# Altium schematic sheet digital.SchDoc
size B
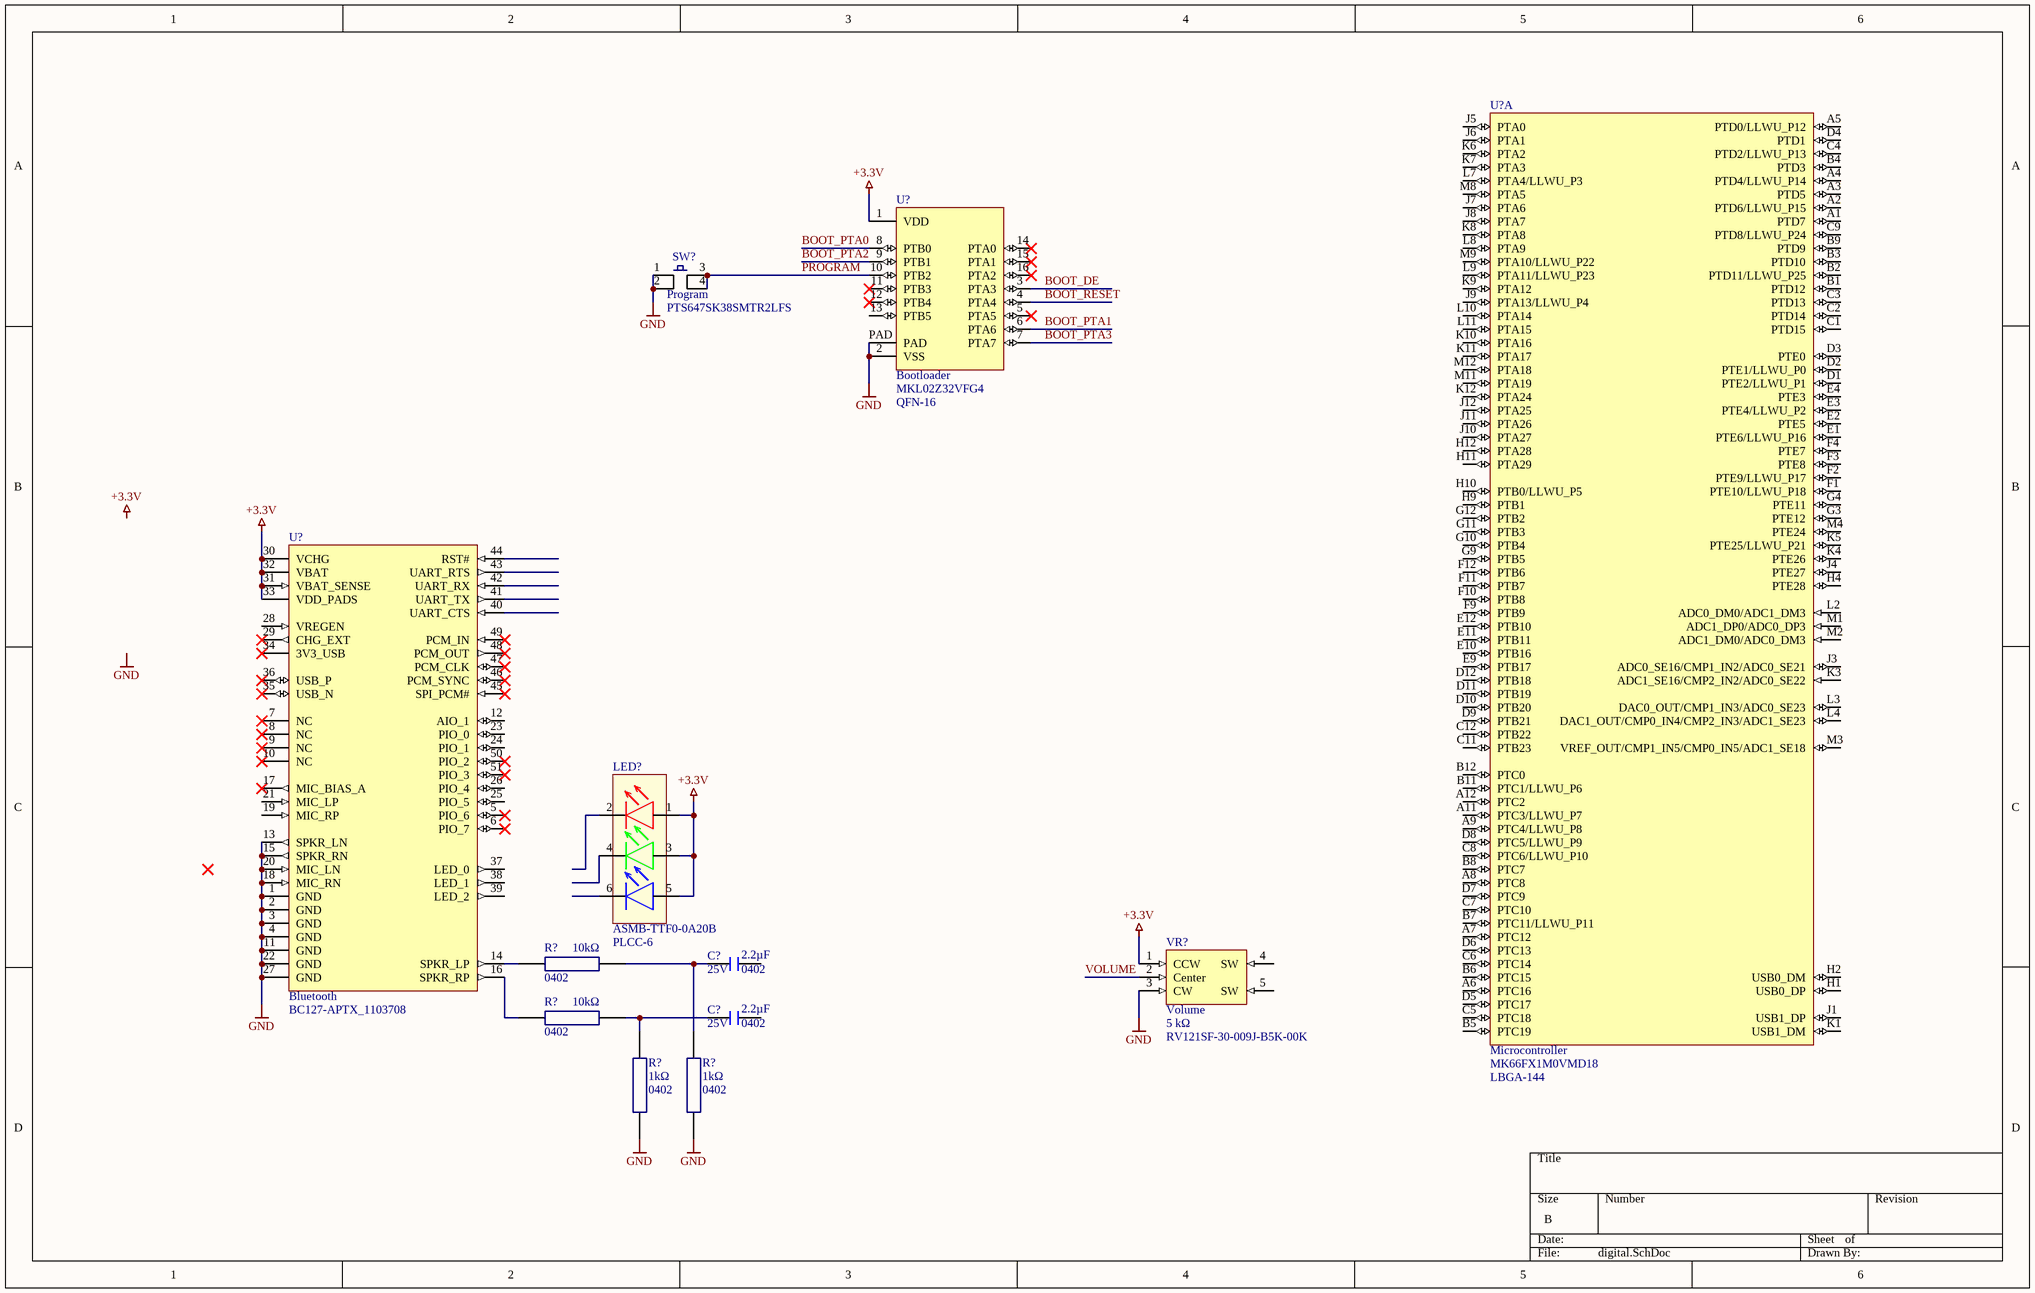
[diagram p0: digital.SchDoc]

## Parts
(Parts that share a designator on the sheet are numbered #1, #2 ... from top to bottom, then left to right.)
C?#1  Size Code: 0402  Capacitance: 2.2µF  Rated DC Voltage (URdc): 25V  [0402_capacitor]  (hidden comment: TMK105CBJ225MV-F)
C?#2  Size Code: 0402  Capacitance: 2.2µF  Rated DC Voltage (URdc): 25V  [0402_capacitor]  (hidden comment: TMK105CBJ225MV-F)
LED?  ASMB-TTF0-0A20B  [PLCC-6]
R?#1  Case Code (Imperial): 0402  Resistance: 10kΩ  [0402_resistor]  (hidden comment: RMCF0402FT10K0)
R?#2  Case Code (Imperial): 0402  Resistance: 10kΩ  [0402_resistor]  (hidden comment: RMCF0402FT10K0)
R?#3  Resistance: 1kΩ  Size Code: 0402  [0402_resistor]  (hidden comment: RMCF0402FT1K00)
R?#4  Resistance: 1kΩ  Size Code: 0402  [0402_resistor]  (hidden comment: RMCF0402FT1K00)
SW?  Program  [PTS647SK38SMTR2LFS]
U?#1  Bootloader  [QFN-16]
U?#2  Microcontroller  Package: LBGA-144  [BGA-144]  (part A of 2)
U?#3  Bluetooth  [BC127]
VR?  Volume  Resistance: 5 kΩ  [RV121SF-30-009J-B5K-00K]

## Nets
+3.3V: LED?.1 LED?.3 LED?.5 U?#1.1(VDD) U?#3.30(VCHG) U?#3.31(VBAT_SENSE) U?#3.32(VBAT) U?#3.33(VDD_PADS) VR?.1(CCW)
GND: R?#3.1 R?#4.1 SW?.1 SW?.2 U?#1.2(VSS) U?#1.PAD U?#3.1(GND) U?#3.2(GND) U?#3.3(GND) U?#3.4(GND) U?#3.11(GND) U?#3.13(SPKR_LN) U?#3.15(SPKR_RN) U?#3.18(MIC_RN) U?#3.20(MIC_LN) U?#3.22(GND) U?#3.27(GND) VR?.3(CW)
BOOT_DE: U?#1.3(PTA3)
BOOT_PTA0: U?#1.8(PTB0)
BOOT_PTA1: U?#1.6(PTA6)
BOOT_PTA2: U?#1.9(PTB1)
BOOT_PTA3: U?#1.7(PTA7)
BOOT_RESET: U?#1.4(PTA4)
PROGRAM: SW?.3 SW?.4 U?#1.10(PTB2)
VOLUME: VR?.2(Center)
NetC?#1_1: C?#1.1 R?#1.2 R?#4.2
NetC?#2_1: C?#2.1 R?#2.2 R?#3.2
NetR?#1_1: R?#1.1 U?#3.14(SPKR_LP)
NetR?#2_1: R?#2.1 U?#3.16(SPKR_RP)

Not connected (* = marked no-connect by the designer): C?#1 2; C?#2 2; LED? 2 4 6; U?#1 5(PTA5)* 11(PTB3)* 12(PTB4)* 13(PTB5) 14(PTA0)* 15(PTA1)* 16(PTA2)*; U?#2 A1(PTD7) A2(PTD6/LLWU_P15) A3(PTD5) A4(PTD4/LLWU_P14) A5(PTD0/LLWU_P12) A6(PTC16) A7(PTC12) A8(PTC8) A9(PTC4/LLWU_P8) A11(PTC3/LLWU_P7) A12(PTC2) B1(PTD12) B2(PTD11/LLWU_P25) B3(PTD10) B4(PTD3) B5(PTC19) B6(PTC15) B7(PTC11/LLWU_P11) B8(PTC7) B9(PTD9) B11(PTC1/LLWU_P6) B12(PTC0) C1(PTD15) C2(PTD14) C3(PTD13) C4(PTD2/LLWU_P13) C5(PTC18) C6(PTC14) C7(PTC10) C8(PTC6/LLWU_P10) C9(PTD8/LLWU_P24) C11(PTB23) C12(PTB22) D1(PTE2/LLWU_P1) D2(PTE1/LLWU_P0) D3(PTE0) D4(PTD1) D5(PTC17) D6(PTC13) D7(PTC9) D8(PTC5/LLWU_P9) D9(PTB21) D10(PTB20) D11(PTB19) D12(PTB18) E1(PTE6/LLWU_P16) E2(PTE5) E3(PTE4/LLWU_P2) E4(PTE3) E9(PTB17) E10(PTB16) E11(PTB11) E12(PTB10) F1(PTE10/LLWU_P18) F2(PTE9/LLWU_P17) F3(PTE8) F4(PTE7) F9(PTB9) F10(PTB8) F11(PTB7) F12(PTB6) G3(PTE12) G4(PTE11) G9(PTB5) G10(PTB4) G11(PTB3) G12(PTB2) H1(USB0_DP) H2(USB0_DM) H4(PTE28) H9(PTB1) H10(PTB0/LLWU_P5) H11(PTA29) H12(PTA28) J1(USB1_DP) J3(ADC0_SE16/CMP1_IN2/ADC0_SE21) J4(PTE27) J5(PTA0) J6(PTA1) J7(PTA6) J8(PTA7) J9(PTA13/LLWU_P4) J10(PTA27) J11(PTA26) J12(PTA25) K1(USB1_DM) K3(ADC1_SE16/CMP2_IN2/ADC0_SE22) K4(PTE26) K5(PTE25/LLWU_P21) K6(PTA2) K7(PTA3) K8(PTA8) K9(PTA12) K10(PTA16) K11(PTA17) K12(PTA24) L2(ADC0_DM0/ADC1_DM3) L3(DAC0_OUT/CMP1_IN3/ADC0_SE23) L4(DAC1_OUT/CMP0_IN4/CMP2_IN3/ADC1_SE23) L7(PTA4/LLWU_P3) L8(PTA9) L9(PTA11/LLWU_P23) L10(PTA14) L11(PTA15) M1(ADC1_DP0/ADC0_DP3) M2(ADC1_DM0/ADC0_DM3) M3(VREF_OUT/CMP1_IN5/CMP0_IN5/ADC1_SE18) M4(PTE24) M8(PTA5) M9(PTA10/LLWU_P22) M11(PTA19) M12(PTA18); U?#3 5(PIO_6)* 6(PIO_7)* 7(NC)* 8(NC)* 9(NC)* 10(NC)* 12(AIO_1) 17(MIC_BIAS_A)* 19(MIC_RP) 21(MIC_LP) 23(PIO_0) 24(PIO_1) 25(PIO_5) 26(PIO_4) 28(VREGEN) 29(CHG_EXT)* 34(3V3_USB)* 35(USB_N)* 36(USB_P)* 37(LED_0) 38(LED_1) 39(LED_2) 40(UART_CTS) 41(UART_TX) 42(UART_RX) 43(UART_RTS) 44(RST#) 45(SPI_PCM#)* 46(PCM_SYNC)* 47(PCM_CLK)* 48(PCM_OUT)* 49(PCM_IN)* 50(PIO_2)* 51(PIO_3)*; VR? 4(SW) 5(SW)

## Notes on the sheet
- Labels drawn without touching a wire or pin: +3.3V, GND

## Library data of the parts
C?#1 C?#2 = TMK105CBJ225MV-F: 2.2 µF, 25 V, X5R, 0402 Chip Capacitor; Manufacturer: Taiyo Yuden; Dielectric Material: Ceramic; Multilayer: Yes; Negative Tolerance: 20%; Supplier 1: Digi-Key; Supplier Part Number 1: 587-6022-1-ND; RoHS: Yes; Category: Ceramic Capacitors; Stock 1: 6102; Pricing 1: 1=0.22000, 10=0.15600, 50=0.08880, 100=0.07350, 500=0.05156, 1000=0.04269, 2500=0.03973, 5000=0.03635 (USD); Mount: Surface Mount; Number of Pins: 2; Package Shape: Rectangular; Min Operating Temperature: -55°C; Max Operating Temperature: 85°C; Capacitor Type: Ceramic; Package Style: SMTMeter; Packaging: Tape and Reel; Positive Tolerance: 20%; Temperature Characteristics Code: X5R; Termination: Wraparound; Length: 1mm; Width: 0.5mm; Height: 0.5mm; REACH SVHC: Yes; RoHS Compliant: Yes; ComponentLink1URL: https://datasheet.ciiva.com:443/pdfs/VipMasterIC/IC/TAIY/TAIY-S-A0009103435/TAIY-S-A0009102688-1.pdf?src-supplier=IHS+Markit; ComponentLink1Description: https://datasheet.ciiva.com:443/pdfs/VipMasterIC/IC/TAIY/TAIY-S-A0009103435/TAIY-S-A0009102688-1.pdf?src-supplier=IHS+Markit; ComponentLink2URL: https://ds.yuden.co.jp/TYCOMPAS/ut/detail?pn=TMK105CBJ225MV-F &amp;u=M&src-supplier=Digi-Key; ComponentLink2Description: https://ds.yuden.co.jp/TYCOMPAS/ut/detail?pn=TMK105CBJ225MV-F &amp;u=M&src-supplier=Digi-Key; ComponentLink3URL: http://ds.yuden.co.jp/TYCOMPAS/ut/detail.do?productNo=TMK105CBJ225MV-F&amp;fileName=TMK105CBJ225MV-F_SS&amp;mode=specSheetDownload&src-supplier=Digi-Key; ComponentLink3Description: http://ds.yuden.co.jp/TYCOMPAS/ut/detail.do?productNo=TMK105CBJ225MV-F&amp;fileName=TMK105CBJ225MV-F_SS&amp;mode=specSheetDownload&src-supplier=Digi-Key; Manufacturer Part Number: TMK105CBJ225MV-F
LED? = ASMB-TTF0-0A20B: RGB LED; Manufacturer: Broadcom Avago; Color: Blue,Green,Red; Lens Style: Round,Flat; Lens Transparency: Diffused; Luminous Intensity: 410mcd; Forward Voltage: 2.9V; Test Current: 20mA; Viewing Angle: 110°; Dominant Wavelength: 471nm; Supplier 1: Digi-Key; RoHS: Yes; Category: LEDs; Stock 1: 27651; Pricing 1: 1=0.55000, 10=0.33900, 100=0.19500, 1000=0.15264 (USD); Mount: Surface Mount; Number of Pins: 6; Packaging: Cut Tape; Length: 3.7mm; Width: 3.5mm; Height: 3mm; RoHS Compliant: Yes; ComponentLink1URL: https://media.digikey.com/pdf/Data%20Sheets/Avago%20PDFs/ASMB-TTF0-0A20B.pdf?src-supplier=Digi-Key; ComponentLink1Description: https://media.digikey.com/pdf/Data%20Sheets/Avago%20PDFs/ASMB-TTF0-0A20B.pdf?src-supplier=Digi-Key; ComponentLink2URL: http://www.farnell.com/datasheets/2608170.pdf?src-supplier=Farnell; ComponentLink2Description: http://www.farnell.com/datasheets/2608170.pdf?src-supplier=Farnell; ComponentLink3URL: http://www.farnell.com/datasheets/2608170.pdf?src-supplier=Newark; ComponentLink3Description: http://www.farnell.com/datasheets/2608170.pdf?src-supplier=Newark; Supplier Part Number 1: 516-3908-1-ND; Supplier 2: Digi-Key; Supplier Part Number 2: 516-3909-1-ND; Manufacturer Part Number: ASMB-TTF0-0A20B; Case/Package: PLCC-6
R?#1 R?#2 = RMCF0402FT10K0: 10 kΩ, 0402 Chip resistor; Manufacturer: Stackpole Electronics; Tolerance: 1%; Power Rating: 62.5mW; Temperature Coefficient: 100ppm/°C; Max Power Dissipation: 63mW; Supplier 1: Digi-Key; Manufacturer Part Number: RMCF0402FT10K0; RoHS: Yes; Category: Chip SMD Resistors; Stock 1: 7219214; Pricing 1: 1=0.10000, 10=0.01300, 100=0.00530, 1000=0.00239, 2500=0.00207, 5000=0.00171 (USD); Mount: Surface Mount; Case/Package: 0402; Case Code (Metric): 1005; Contact Plating: Tin,Matte; Size Code: 0402; Min Operating Temperature: -55°C; Max Operating Temperature: 155°C; Packaging: Tape and Reel; Resistor Type: Thick Film; Number of Terminations: 2; Features: Automotive AEC-Q200; Series: RMCF; Construction: Rectangular; Length: 1mm; Width: 0.02inch; Height: 0.016inch; Depth: 0.5mm; Radiation Hardening: No; Military Standard: Not; Lead Free: Lead Free; RoHS Compliant: Yes; ComponentLink1URL: https://datasheet.ciiva.com/24341/sei-rmcp-24341800.pdf?src-supplier=Onlinecomponents.com; ComponentLink1Description: https://datasheet.ciiva.com/24341/sei-rmcp-24341800.pdf?src-supplier=Onlinecomponents.com; Supplier Part Number 1: RMCF0402FT10K0CT-ND
R?#3 R?#4 = RMCF0402FT1K00: 1 kΩ, 0402 Chip resistor; Manufacturer: Stackpole Electronics; Tolerance: 1%; Power Rating: 63mW; Temperature Coefficient: 100ppm/°C; Manufacturer Part Number: RMCF0402FT1K00; RoHS: Yes; Category: Chip SMD Resistors; Stock 1: 304945; Pricing 1: 1=0.00420, 500=0.00300, 1500=0.00290, 2500=0.00280, 5000=0.00270 (USD); Mount: Surface Mount; Case/Package: 0402; Case Code (Metric): 1005; Case Code (Imperial): 0402; Contact Plating: Tin,Matte; Min Operating Temperature: -55°C; Max Operating Temperature: 155°C; Packaging: Tape and Reel; Resistor Type: Thick Film; Number of Terminations: 2; Max Power Dissipation: 63mW; Features: Automotive AEC-Q200; Series: RMCF; Construction: Rectangular; Length: 1mm; Width: 0.02inch; Height: 0.016inch; Depth: 0.5mm; Radiation Hardening: No; Military Standard: Not; Lead Free: Lead Free; RoHS Compliant: Yes; ComponentLink1URL: https://datasheet.ciiva.com/15193/getdatasheetpartid-365385-15193418.pdf?src-supplier=Verical; ComponentLink1Description: https://datasheet.ciiva.com/15193/getdatasheetpartid-365385-15193418.pdf?src-supplier=Verical; ComponentLink2URL: https://datasheet.ciiva.com/24336/sei-rmcp-24336266.pdf?src-supplier=Onlinecomponents.com; ComponentLink2Description: https://datasheet.ciiva.com/24336/sei-rmcp-24336266.pdf?src-supplier=Onlinecomponents.com; Supplier 1: Digi-Key; Supplier Part Number 1: RMCF0402FT1K00CT-ND
SW? = PTS647SK38SMTR2LFS: Tactile switch, SPST; Manufacturer: ITT C&K; Mechanical Life: 100000Cycles; Illumination Type: Non-Illuminated; Switch Function: Off-Mom; Actuator Type: Standard; Operating Force: 250gf; Switch Travel: 0.25mm; Ratings: IP40; Supplier 1: Digi-Key; RoHS: No; Category: Tactile Switches; Stock 1: 68566; Pricing 1: 1=0.13000, 10=0.12700, 25=0.12080, 100=0.10970, 250=0.10308, 500=0.09432, 1000=0.07897 (USD); Mount: Surface Mount; Min Operating Temperature: -20°C; Max Operating Temperature: 70°C; Throw Configuration: SPST; Packaging: Tape and Reel; Termination: Gull Wing; ComponentLink1URL: https://www.ckswitches.com/media/2567/pts647.pdf?src-supplier=Digi-Key; ComponentLink1Description: https://www.ckswitches.com/media/2567/pts647.pdf?src-supplier=Digi-Key; Supplier Part Number 1: PTS647SK38SMTR2LFSCT-ND; Manufacturer Part Number: PTS647SK38SMTR2LFS
U?#1 = MKL02Z32VFG4: ARM Cortex-M0+; Manufacturer: NXP Freescale; Max Supply Voltage: 3.6V; RAM Size: 4KB; Number of USB Channels: 1; Number of PWM Channels: 2; Interface: I2C,SPI,UART,USART; Min Supply Voltage: 1.71V; Frequency: 48MHz; Number of I/Os: 14; Oscillator Type: Internal; Data Bus Width: 32b; Memory Type: FLASH; Memory Size: 32KB; Peripherals: Brown-out Detect/Reset,POR,PWM,WDT,LVD; Supplier 1: Digi-Key; Stock 1: 0; Pricing 1: 1=3.31, 10=2.584, 80=2.332 (USD); Mount: Surface Mount; Case/Package: QFN; Number of Pins: 16; Weight: 0.000564oz; Min Operating Temperature: -40°C; Max Operating Temperature: 105°C; Packaging: Tray; Number of Timers/Counters: 2; Package Quantity: 490; Number of ADC Channels: 1; Number of UART Channels: 1; Max Frequency: 48MHz; Number of SPI Channels: 1; Number of I2C Channels: 2; Core Architecture: ARM; Length: 3mm; Width: 3mm; Height: 0.75mm; REACH SVHC: No SVHC; RoHS Compliant: Yes; ComponentLink1URL: http://www.farnell.com/datasheets/1898381.pdf?src-supplier=Element14; ComponentLink1Description: http://www.farnell.com/datasheets/1898381.pdf?src-supplier=Element14; ComponentLink2URL: http://uk.rs-online.com/webdocs/12ba/0900766b812babaa.pdf?src-supplier=RSComponents; ComponentLink2Description: http://uk.rs-online.com/webdocs/12ba/0900766b812babaa.pdf?src-supplier=RSComponents; ComponentLink3URL: http://cache.freescale.com/files/32bit/doc/data_sheet/KL02P32M48SF0.pdf?src-supplier=Digi-Key; ComponentLink3Description: http://cache.freescale.com/files/32bit/doc/data_sheet/KL02P32M48SF0.pdf?src-supplier=Digi-Key; Supplier Part Number 1: MKL02Z32VFG4-ND; Manufacturer Part Number: MKL02Z32VFG4; Package: QFN-16
U?#2 = MK66FX1M0VMD18: ARM Cortex-M4 microcontroller; Manufacturer: NXP Freescale; Supplier 1: Digi-Key; Stock 1: 0; Pricing 1: 1=23.34, 10=23.108 (USD); RoHS Compliant: Yes; ComponentLink1URL: http://www.mouser.com/ds/2/302/K66P144M180SF5V2-907544.pdf?src-supplier=Mouser; ComponentLink1Description: http://www.mouser.com/ds/2/302/K66P144M180SF5V2-907544.pdf?src-supplier=Mouser; ComponentLink2URL: https://www.nxp.com/docs/en/package-information/98ASA00222D.pdf?src-supplier=Digi-Key; ComponentLink2Description: https://www.nxp.com/docs/en/package-information/98ASA00222D.pdf?src-supplier=Digi-Key; ComponentLink3URL: http://www.farnell.com/datasheets/2292635.pdf?src-supplier=Farnell; ComponentLink3Description: http://www.farnell.com/datasheets/2292635.pdf?src-supplier=Farnell; ComponentLink4URL: http://www.farnell.com/datasheets/2292635.pdf?src-supplier=Newark; ComponentLink4Description: http://www.farnell.com/datasheets/2292635.pdf?src-supplier=Newark; Supplier Part Number 1: 568-13335-ND; Manufacturer Part Number: MK66FX1M0VMD18
U?#3 = BC127-APTX_1103708: Bluetooth 4.2 Module with Integrated Antenna; Manufacturer: Sierra Wireless; Supplier 1: Digi-Key; Stock 1: 1671; Pricing 1: 1=35.82, 10=33.066, 25=30.3104, 100=28.0142, 250=26.6365, 500=25.05 (USD); Supplier Part Number 1: 1645-1042-1-ND; Manufacturer Part Number: BC127-APTX_1103708
VR? = RV121SF-30-009J-B5K-00K: 5 kΩ Linear potentiomer with switch; Manufacturer Part Number: RV121SF-30-009J-B5K-00K